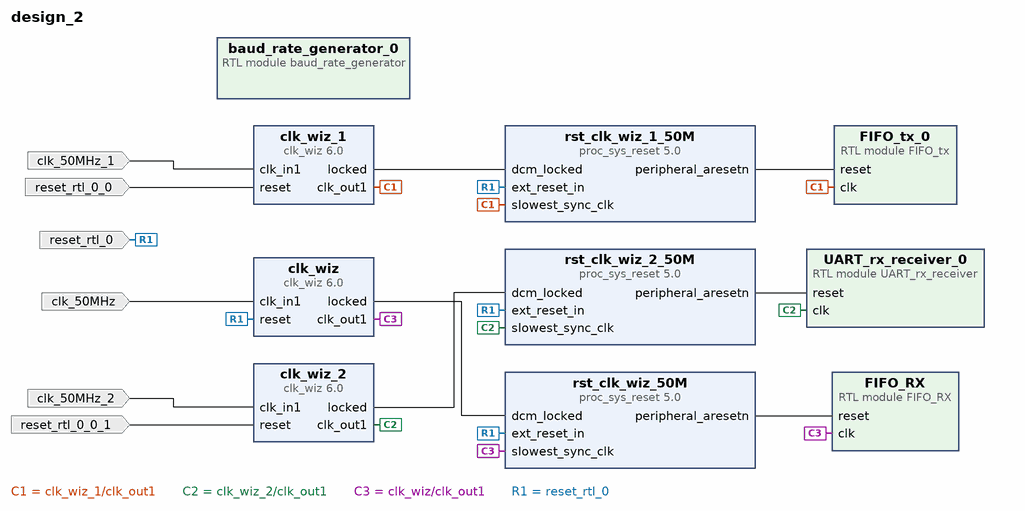
[diagram p0: block diagram of the top level]
# Vivado block design design_2, xc7z010iclg225-1L, Vivado 2021.2
create_bd_design design_2

create_bd_port -dir I -type clk clk_50MHz
set_property -dict {CONFIG.CLK_DOMAIN design_2_clk_50MHz CONFIG.FREQ_HZ 50000000} [get_bd_ports clk_50MHz]
create_bd_port -dir I -type rst reset_rtl_0
set_property -dict {CONFIG.POLARITY ACTIVE_HIGH} [get_bd_ports reset_rtl_0]
create_bd_port -dir I -type clk clk_50MHz_1
set_property -dict {CONFIG.CLK_DOMAIN design_2_clk_50MHz_1 CONFIG.FREQ_HZ 50000000} [get_bd_ports clk_50MHz_1]
create_bd_port -dir I -type rst reset_rtl_0_0
set_property -dict {CONFIG.POLARITY ACTIVE_HIGH} [get_bd_ports reset_rtl_0_0]
create_bd_port -dir I -type clk clk_50MHz_2
set_property -dict {CONFIG.FREQ_HZ 100000000} [get_bd_ports clk_50MHz_2]
create_bd_port -dir I -type rst reset_rtl_0_0_1
set_property -dict {CONFIG.POLARITY ACTIVE_HIGH} [get_bd_ports reset_rtl_0_0_1]

create_bd_cell -type ip -vlnv xilinx.com:ip:clk_wiz:6.0 clk_wiz
create_bd_cell -type ip -vlnv xilinx.com:ip:proc_sys_reset:5.0 rst_clk_wiz_50M
create_bd_cell -type ip -vlnv xilinx.com:ip:clk_wiz:6.0 clk_wiz_1
create_bd_cell -type ip -vlnv xilinx.com:ip:proc_sys_reset:5.0 rst_clk_wiz_1_50M
create_bd_cell -type ip -vlnv xilinx.com:ip:clk_wiz:6.0 clk_wiz_2
create_bd_cell -type ip -vlnv xilinx.com:ip:proc_sys_reset:5.0 rst_clk_wiz_2_50M
create_bd_cell -type module -reference FIFO_tx FIFO_tx_0
create_bd_cell -type module -reference baud_rate_generator baud_rate_generator_0
create_bd_cell -type module -reference UART_rx_receiver UART_rx_receiver_0
create_bd_cell -type module -reference FIFO_RX FIFO_RX

# ---- connections ----

connect_bd_net -net clk_100MHz_1 [get_bd_ports clk_50MHz] [get_bd_pins clk_wiz/clk_in1]
connect_bd_net -net clk_100MHz_1_1 [get_bd_ports clk_50MHz_1] [get_bd_pins clk_wiz_1/clk_in1]
connect_bd_net -net clk_100MHz_2_1 [get_bd_ports clk_50MHz_2] [get_bd_pins clk_wiz_2/clk_in1]
connect_bd_net [get_bd_pins clk_wiz_1/clk_out1] [get_bd_pins rst_clk_wiz_1_50M/slowest_sync_clk] [get_bd_pins FIFO_tx_0/clk]
connect_bd_net [get_bd_pins clk_wiz_1/locked] [get_bd_pins rst_clk_wiz_1_50M/dcm_locked]
connect_bd_net [get_bd_pins clk_wiz_2/clk_out1] [get_bd_pins rst_clk_wiz_2_50M/slowest_sync_clk] [get_bd_pins UART_rx_receiver_0/clk]
connect_bd_net [get_bd_pins clk_wiz_2/locked] [get_bd_pins rst_clk_wiz_2_50M/dcm_locked]
connect_bd_net [get_bd_pins clk_wiz/clk_out1] [get_bd_pins rst_clk_wiz_50M/slowest_sync_clk] [get_bd_pins FIFO_RX/clk]
connect_bd_net [get_bd_pins clk_wiz/locked] [get_bd_pins rst_clk_wiz_50M/dcm_locked]
connect_bd_net -net reset_rtl_0_0_1 [get_bd_ports reset_rtl_0_0] [get_bd_pins clk_wiz_1/reset]
connect_bd_net -net reset_rtl_0_0_1_1 [get_bd_ports reset_rtl_0_0_1] [get_bd_pins clk_wiz_2/reset]
connect_bd_net -net reset_rtl_0_1 [get_bd_ports reset_rtl_0] \
  [get_bd_pins clk_wiz/reset] [get_bd_pins rst_clk_wiz_1_50M/ext_reset_in] [get_bd_pins rst_clk_wiz_2_50M/ext_reset_in] \
  [get_bd_pins rst_clk_wiz_50M/ext_reset_in]
connect_bd_net -net rst_clk_wiz_100M_peripheral_aresetn [get_bd_pins rst_clk_wiz_50M/peripheral_aresetn] [get_bd_pins FIFO_RX/reset]
connect_bd_net -net rst_clk_wiz_1_100M_peripheral_aresetn [get_bd_pins rst_clk_wiz_1_50M/peripheral_aresetn] [get_bd_pins FIFO_tx_0/reset]
connect_bd_net -net rst_clk_wiz_2_100M_peripheral_aresetn [get_bd_pins rst_clk_wiz_2_50M/peripheral_aresetn] [get_bd_pins UART_rx_receiver_0/reset]

validate_bd_design
save_bd_design
